# EAGLE schematic vqc10 (EAGLE 8.2.0)
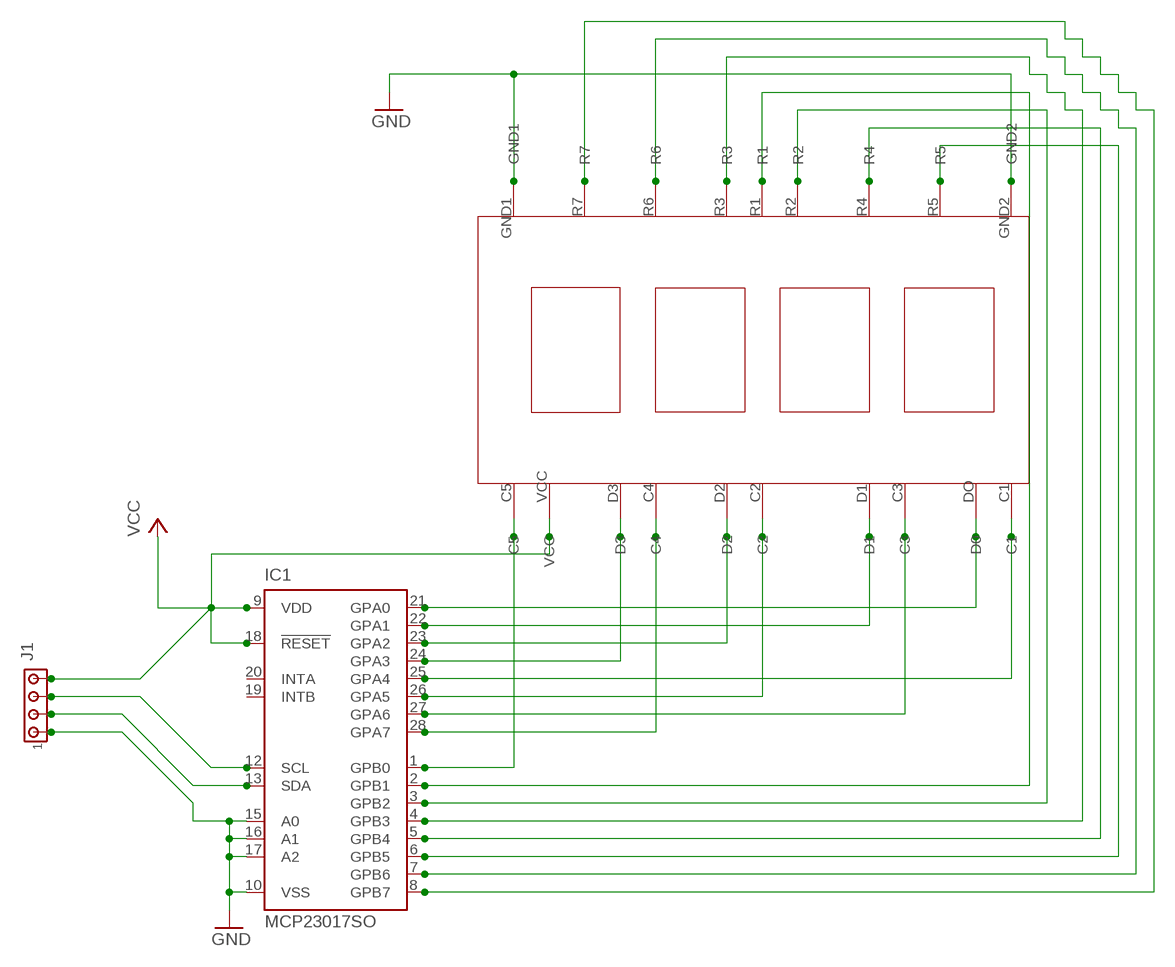
[diagram p0: schematic, sheet 1]

## Parts
IC1  MCP23017SO  [SO28W]
J1  MTA04-100  [10X04MTA]
U$1  VQC10  [30DIP]

## Nets
GND: IC1.10(VSS) IC1.15(A0) IC1.16(A1) IC1.17(A2) J1.1
N$1: IC1.21(GPA0)
N$2: IC1.22(GPA1)
N$3: IC1.23(GPA2)
N$4: IC1.24(GPA3)
N$5: IC1.25(GPA4)
N$6: IC1.26(GPA5)
N$7: IC1.27(GPA6)
N$8: IC1.28(GPA7)
N$9: IC1.1(GPB0)
N$10: IC1.4(GPB3)
N$11: IC1.5(GPB4)
N$12: IC1.2(GPB1)
N$13: IC1.3(GPB2)
N$14: IC1.6(GPB5)
N$15: IC1.7(GPB6)
N$16: IC1.8(GPB7)
N$18: IC1.12(SCL) J1.3
N$19: IC1.13(SDA) J1.2
VCC: IC1.9(VDD) IC1.18(!RESET) J1.4
Unconnected: IC1.19(INTB) IC1.20(INTA) U$1.C1 U$1.C2 U$1.C3 U$1.C4 U$1.C5 U$1.D1 U$1.D2 U$1.D3 U$1.DO(D0) U$1.GND1 U$1.GND2 U$1.R1 U$1.R2 U$1.R3 U$1.R4 U$1.R5 U$1.R6 U$1.R7 U$1.VCC

## Library data of the parts
IC1 = microchip:MCP23017: http://ww1.microchip.com/downloads/en/DeviceDoc/21952a.pdf Source: http://ww1.microchip.com/downloads/en/DeviceDoc/21952a.pdf; MF: MICROCHIP; MPN: MCP23017-E/SO; OC_FARNELL: 1332087; OC_NEWARK: 31K2958
J1 = con-amp:MTA04-100: AMP connector
U$1 = VQC10:VQC10; VQC10: 5x7Matrix